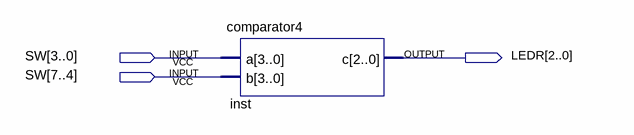
[diagram p0: schematic sheet]
// Quartus schematic block_comparator4.bdf as structural Verilog: 1 symbols, 3 pins
module block_comparator4 (
  input  [7:0] SW,
  output [2:0] LEDR
);

  comparator4 inst (.a(SW[3:0]), .b(SW[7:4]), .c(LEDR));
endmodule
